# EAGLE design lm75_breakout_soic8_sot23 (EAGLE 8.6.0)
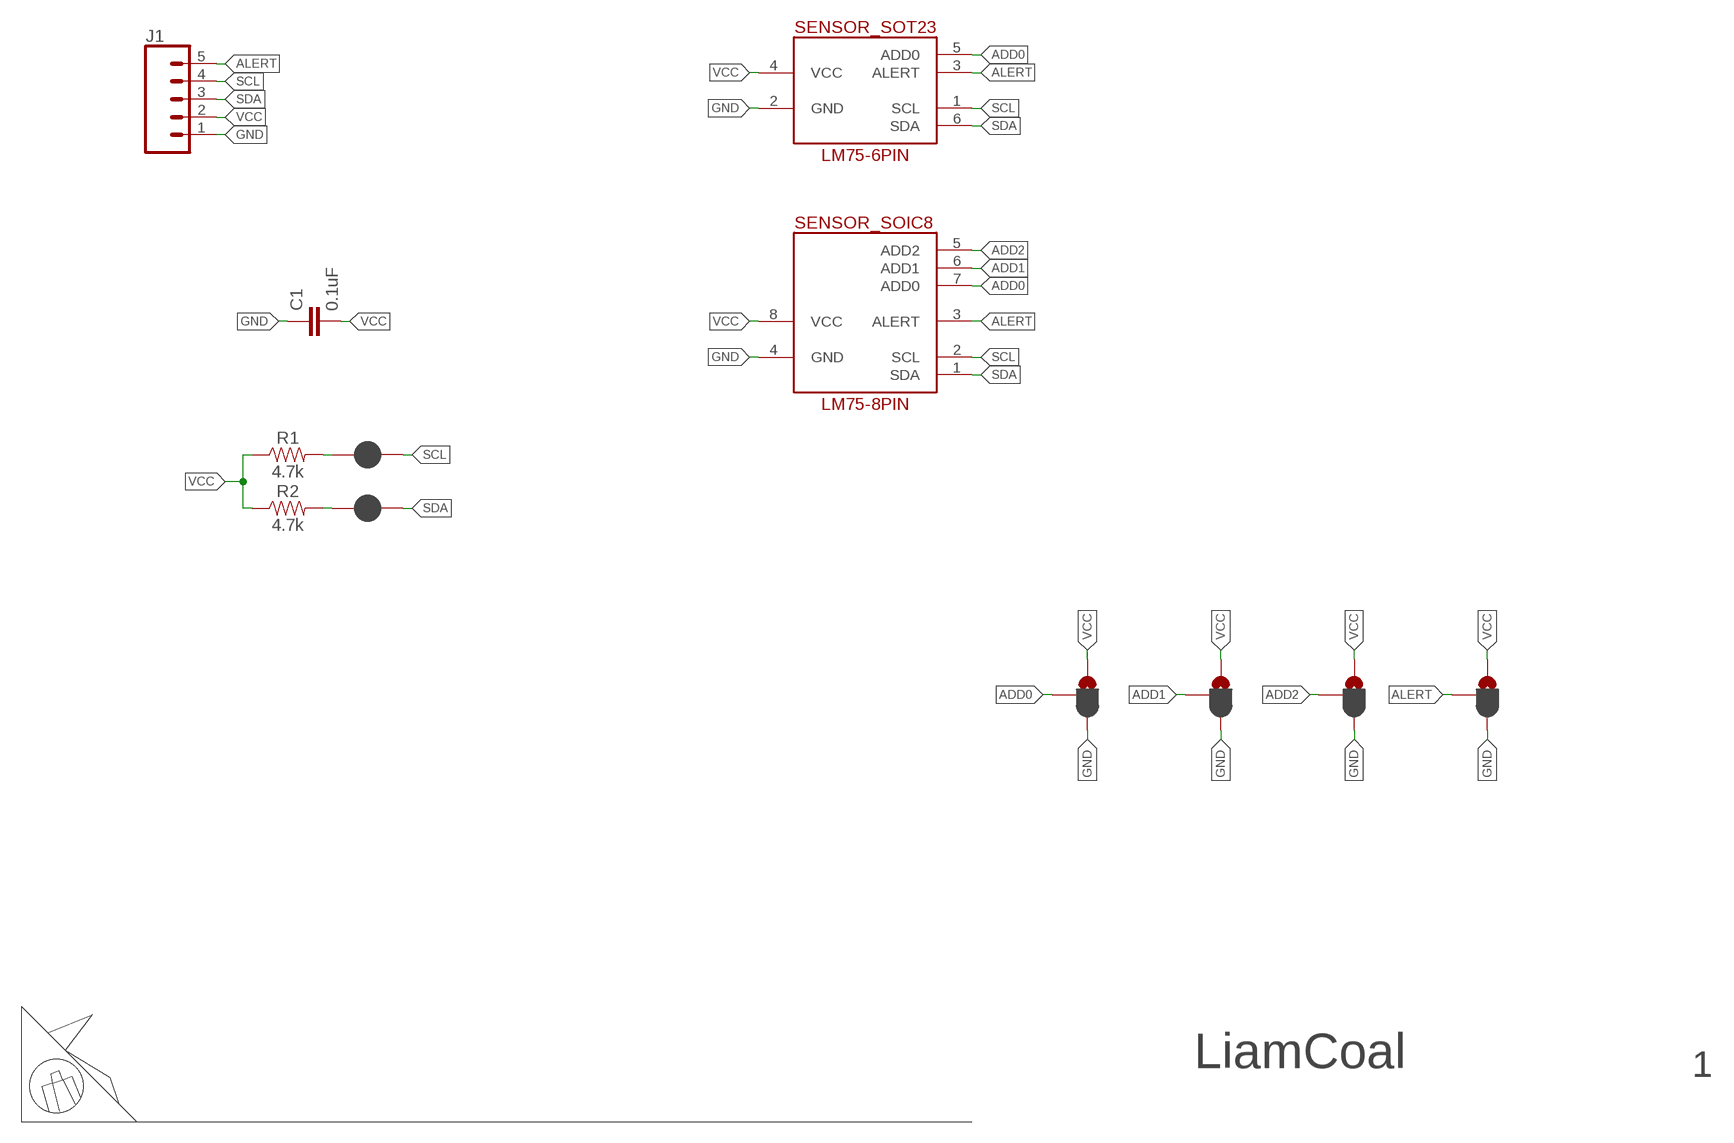
[diagram p0: schematic, sheet 1]

## Parts
C1  0.1uF  0.1UF-0603-100V-10%  [0603]
J1  CONN_05NO_SILK  [1X05_NO_SILK]
JP1  JUMPER-SMT_3_1-NC_PASTE_SILK  [SMT-JUMPER_3_1-NC_PASTE_SILK]
JP2  JUMPER-SMT_3_1-NC_PASTE_SILK  [SMT-JUMPER_3_1-NC_PASTE_SILK]
JP3  JUMPER-SMT_3_1-NC_PASTE_SILK  [SMT-JUMPER_3_1-NC_PASTE_SILK]
JP4  JUMPER-SMT_2_NC_PASTE_SILK  [SMT-JUMPER_2_NC_PASTE_SILK]
JP5  JUMPER-SMT_2_NC_PASTE_SILK  [SMT-JUMPER_2_NC_PASTE_SILK]
JP6  JUMPER-SMT_3_1-NC_PASTE_SILK  [SMT-JUMPER_3_1-NC_PASTE_SILK]
R1  4.7k  4.7KOHM-0603-1/10W-1%  [0603]
R2  4.7k  4.7KOHM-0603-1/10W-1%  [0603]
SENSOR_SOIC8  LM75-8PIN  [SOIC8]
SENSOR_SOT23  LM75-6PIN  [SOT23-6]

## Nets
ADD0: JP1.2 SENSOR_SOIC8.7(ADD0) SENSOR_SOT23.5(ADD0)
ADD1: JP2.2 SENSOR_SOIC8.6(ADD1)
ADD2: JP3.2 SENSOR_SOIC8.5(ADD2)
ALERT: J1.5 JP6.2 SENSOR_SOIC8.3(ALERT) SENSOR_SOT23.3(ALERT)
GND [power]: C1.1 J1.1 JP1.3 JP2.3 JP3.3 JP6.3 SENSOR_SOIC8.4(GND) SENSOR_SOT23.2(GND)
N$1: JP4.1 R1.2
N$2: JP5.1 R2.2
SCL: J1.4 JP4.2 SENSOR_SOIC8.2(SCL) SENSOR_SOT23.1(SCL)
SDA: J1.3 JP5.2 SENSOR_SOIC8.1(SDA) SENSOR_SOT23.6(SDA)
VCC [power]: C1.2 J1.2 JP1.1 JP2.1 JP3.1 JP6.1 R1.1 R2.1 SENSOR_SOIC8.8(VCC) SENSOR_SOT23.4(VCC)

## Notes on the sheet
- LiamCoal | 1

## Library data of the parts
C1 = SparkFun-Capacitors:0.1UF: 0.1µF ceramic capacitors A capacitor is a passive two-terminal electrical component used to store electrical energy temporarily in an electric field.; PROD_ID: CAP-08390
J1 = SparkFun-Connectors:CONN_05: Multi connection point. Often used as Generic Header-pin footprint for 0.1 inch spaced/style header connections On any of the 0.1 inch spaced packages, you can populate with these: Break Away Headers - Straight <https://www.sparkfun.com/products/116> (PRT-00116) Break Away Male Headers - Right Angle <https://www.sparkfun.com/products/553> (PRT-00553) Female Headers <https://www.sparkfun.com/products/115> (PRT-00115) Break Away Headers - Machine Pin <https://www.sparkfun.com/products/117> (PRT-00117) Break Away Female Headers - Swiss Machine Pin <https://www.sparkfun.com/products/743> (PRT-00743) For SCREWTERMINALS and SPRING TERMINALS visit here: Screw Terimnals on SparkFun.com <https://www.sparkfun.com/search/results?term=Screw+Terminals> (5mm/3.5mm/2.54mm spacing) This device is also useful as a general connection point to wire up your design to another part of your project. Our various solder wires solder well into these plated through hole pads. Hook-Up Wire - Assortment (Stranded, 22 AWG) <https://www.sparkfun.com/products/11375> (PRT-11375) Hook-Up Wire - Assortment (Solid Core, 22 AWG) <https://www.sparkfun.com/products/11367> (PRT-11367) View the entire wire category on our website here <https://www.sparkfun.com/categories/141> Special notes: Molex polarized connector foot print use with SKU : PRT-08231 with associated crimp pins and housings. 1MM SMD Version SKU: PRT-10208
JP1-JP3 JP6 = SparkFun-Jumpers:JUMPER-SMT_3_1-NC_PASTE: Normally closed solder jumper (1 of 2 connections) This jumper has an aperture in the stencil to allow solder paste to bridge one of the two connections. One connection is normally closed (NC), while the other is normally open (NO). Wick off the solder to open the connection. Reapply solder to reclose the connection. Apply solder to the other side instead to change the current path.
JP4 JP5 = SparkFun-Jumpers:JUMPER-SMT_2_NC_PASTE: Normally closed solder jumper This jumper has an aperture in the stencil to allow solder paste to bridge the split in the wire so it's normally closed (NC). Wick off the solder to open the connection. Reapply solder to reclose the connection.
R1 R2 = SparkFun-Resistors:4.7KOHM: 4.7kΩ resistor A resistor is a passive two-terminal electrical component that implements electrical resistance as a circuit element. Resistors act to reduce current flow, and, at the same time, act to lower voltage levels within circuits. - Wikipedia; PROD_ID: RES-07857
SENSOR_SOIC8 = Temperature_Breakout:LM75-8PIN
SENSOR_SOT23 = Temperature_Breakout:LM75-6PIN

## Net classes
1 power: width 0.254 mm

## Board
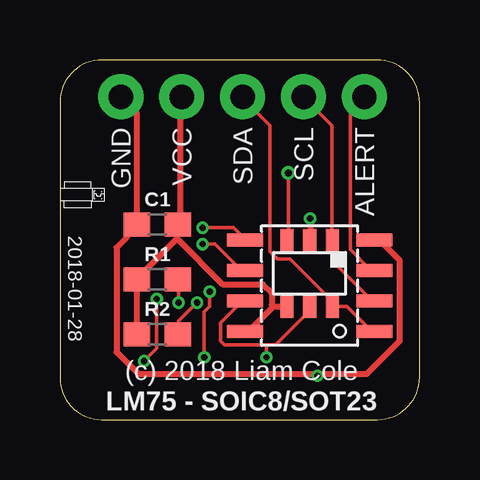
[diagram p1: board, top side]
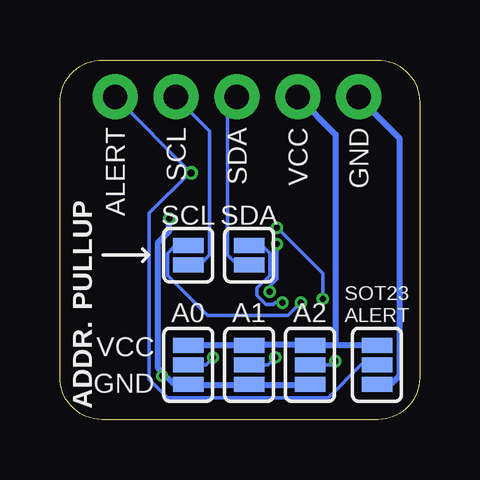
[diagram p2: board, bottom side, seen from below]

Size 15 x 15 mm. Coordinates in mm from the lower left corner, seen from the top.
Outline: 15,1.76 15,13.22 arc90 13.22,15 1.76,15 arc90 0,13.24 0,1.73 arc90 1.73,0 13.24,0 arc90 15,1.76
Copper layers (1*16): Top 0.035559375mm / dielectric 1.6mm / Bottom 0.035559375mm
Design rules "oshpark-2layer *": minimum track width 6mil, minimum drill 10mil, track to track 6mil, track to pad 6mil, pad to pad 6mil, via to via 6mil, smd to smd 6mil, copper to edge 15mil, drill to drill 6mil, minimum pad ring 5mil, minimum via ring 5mil, stop-mask expansion 2.5mil, vias tented up to drill 15mil, thermal gap 10mil

### Footprints (pad centres in the part's own frame; a part is rotated, then mirrored left to right if it is on the bottom)
0603 = smd 1.1 x 1: 1 -0.85,0; 2 0.85,0
1X05_NO_SILK = drill 1.016 pad 1.88: 1 0,0; 2 2.54,0; 3 5.08,0; 4 7.62,0; 5 10.16,0
SMT-JUMPER_3_1-NC_PASTE_SILK = smd 0.635 x 1.27: 1 -0.813,0; 2 0,0; 3 0.813,0
SMT-JUMPER_2_NC_PASTE_SILK = smd 0.635 x 1.27: 1 -0.406,0; 2 0.406,0
SOIC8 = smd 0.55 x 1.5: 1 -1.905,-2.7; 2 -0.635,-2.7; 3 0.635,-2.7; 4 1.905,-2.7; 5 1.905,2.7; 6 0.635,2.7; 7 -0.635,2.7; 8 -1.905,2.7
SOT23-6 = smd 0.55 x 1: 1 -0.95,-1.35; 2 0,-1.35; 3 0.95,-1.35; 4 0.95,1.35; 5 0,1.35; 6 -0.95,1.35

### Placement (x,y rotation side)
C1  4.06,8.13 0 top
J1  2.54,13.46 0 top
JP1  9.65,2.29 270 bottom
JP2  7.11,2.29 270 bottom
JP3  4.57,2.29 270 bottom
JP4  9.65,6.86 270 bottom
JP5  7.11,6.86 270 bottom
JP6  1.78,2.29 270 bottom
R1  4.06,5.84 0 top
R2  4.06,3.56 0 top
SENSOR_SOIC8  10.41,5.59 90 top
SENSOR_SOT23  10.41,6.1 180 top

### Tracks (layer width: path | path; a pad name or v marks a point on that pad's centre or on a via)
ADD0  (via drill 0.25)
  Top 0.152: 8.61,3.12 6.86,3.12 6.71,3.28 6.71,4.04 7.62,4.95 SENSOR_SOIC8.7 | 8.61,3.12 8.99,3.12 10.36,4.5 10.36,4.72 SENSOR_SOT23.5 | 8.61,3.12 v8.61,2.59
  Bottom 0.152: JP1.2 8.91,2.29 v8.61,2.59
ADD1  (via drill 0.25)
  Top 0.152: v6.02,2.59 6.02,4.5 6.25,4.72 v6.25,5.33 | v5.94,7.32 6.48,7.32 7.54,6.25 7.7,6.25 SENSOR_SOIC8.6
  Bottom 0.152: JP2.2 6.33,2.29 v6.02,2.59 | v6.25,5.33 6.25,5.56 5.94,5.87 v5.94,7.32
ADD2  (via drill 0.25)
  Top 0.152: v3.5,2.44 4.04,2.97 v4.04,5.03 | v5.94,8 7.24,8 7.7,7.54 SENSOR_SOIC8.5
  Bottom 0.152: JP3.2 3.66,2.29 v3.5,2.44 | v4.04,5.03 4.04,6.1 v5.94,8
ALERT  (via drill 0.3)
  Top 0.152: v9.53,10.29 9.53,7.47 SENSOR_SOT23.3 | J1.5 12.12,12.88 12.12,7.09 12.95,6.25 13.11,6.25 SENSOR_SOIC8.3
  Bottom 0.152: J1.5 v9.53,10.29 9.6,10.29 11.28,8.61 11.28,1.68 10.52,0.91 3.81,0.91 2.44,2.29 JP6.2
GND  (via drill 0.25)
  Top 0.254: v10.44,8.38 10.44,7.47 SENSOR_SOT23.2 | J1.1 3.2,12.8 3.2,8.15 C1.1 3.2,8 2.36,7.16 2.36,2.82 3.28,1.91 10.74,1.91 | 10.74,1.91 12.8,1.91 14.17,3.28 14.17,6.63 13.34,7.47 13.18,7.47 SENSOR_SOIC8.4 | v10.74,1.83 10.74,1.91
  Bottom 0.254: JP3.3 4.57,1.45 7.09,1.45 JP2.3 7.16,1.45 9.6,1.45 JP1.3 9.68,1.52 10.29,1.52 10.67,1.91 | v10.44,8.38 10.44,7.85 10.9,7.39 10.9,2.13 10.67,1.91 | JP6.3 1.75,1.52 1.14,1.52 0.84,1.83 0.84,11.73 2.52,13.41 J1.1 | v10.74,1.83 10.67,1.91
N$1  (via drill 0.25)
  Top 0.152: v4.95,4.88 4.95,5.79 R1.2
  Bottom 0.152: v4.95,4.88 5.49,4.34 8.84,4.34 10.52,6.02 10.52,6.93 10.21,7.24 9.68,7.24 JP4.1
N$2  (via drill 0.25)
  Top 0.152: v5.71,4.88 4.95,4.12 4.95,3.58 R2.2
  Bottom 0.152: v5.71,4.88 6.02,4.88 6.1,4.8 6.4,4.8 6.78,5.18 6.78,5.49 6.25,6.02 6.25,6.93 6.55,7.24 7.09,7.24 JP5.1
SCL
  Top 0.152: SENSOR_SOIC8.2 13.03,4.95 11.43,6.55 11.43,7.39 SENSOR_SOT23.1 11.35,7.47 11.35,12.27 J1.4
  Bottom 0.152: JP4.2 9.6,6.48 9.14,6.48 8.76,6.86 8.76,12.04 10.13,13.41 J1.4
SDA
  Top 0.152: SENSOR_SOIC8.1 13.11,3.73 12.95,3.73 11.96,4.72 11.43,4.72 SENSOR_SOT23.6 11.35,4.8 11.35,4.95 9.6,6.71 9.07,6.71 8.76,7.01 8.76,12.27 7.62,13.41 J1.3
  Bottom 0.152: JP5.2 7.16,6.48 7.62,6.48 8,6.86 8,13.03 7.62,13.41 J1.3
VCC
  Top 0.254: 8.91,4.72 9.45,4.72 SENSOR_SOT23.4 | 8.91,4.72 7.92,3.73 7.77,3.73 SENSOR_SOIC8.8 | R2.1 3.2,3.58 3.2,5.79 R1.1 3.28,5.94 4.88,7.54 | 4.88,7.54 4.88,8.08 C1.2 5.03,8.15 5.03,13.41 J1.2 | 4.88,7.54 6.78,5.64 8.46,5.64 8.84,5.26 8.84,4.8 8.91,4.72
  Bottom 0.254: JP1.1 9.6,3.12 7.16,3.12 JP2.1 7.01,3.12 4.65,3.12 JP3.1 4.57,3.12 3.5,3.12 | 3.5,3.12 1.83,3.12 JP6.1 | 3.5,3.12 3.5,11.89 J1.2

### Text on the board
tNames: GND | VCC | SDA | SCL | ALERT | 2018-01-28 | (c) 2018 Liam Cole | LM75 - SOIC8/SOT23
bNames: GND | VCC | SDA | SCL | ALERT | SDA | SCL | PULLUP | SOT23 / ALERT | A2 | A1 | A0 | VCC | GND | ADDR.